# EAGLE schematic Solar_Points (EAGLE 9.6.2)
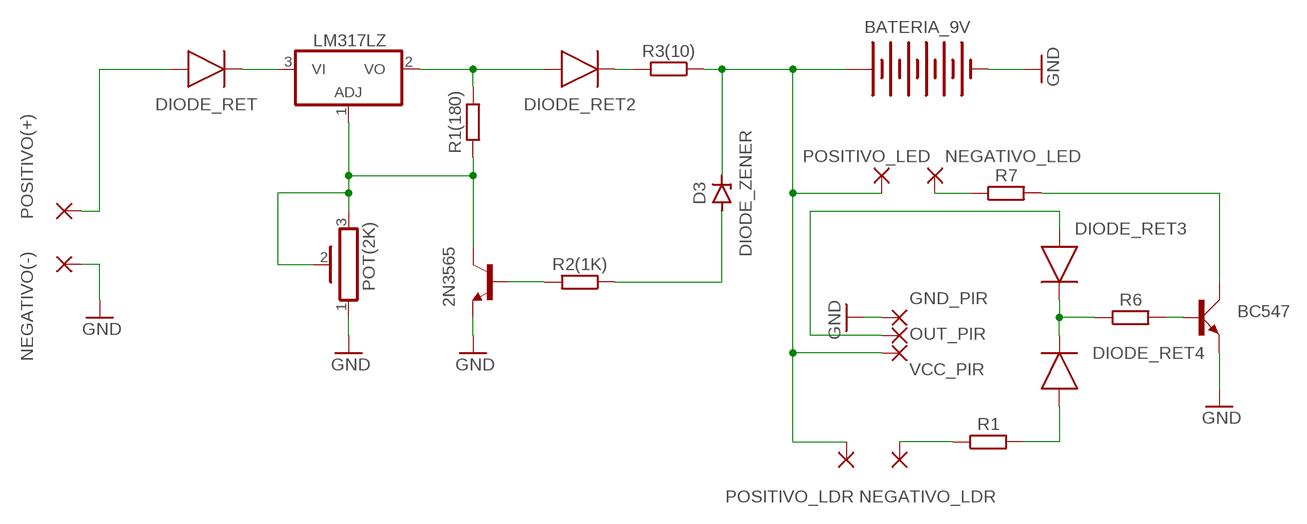
[diagram p0: schematic, sheet 1]

## Parts
2N3565  2N3565  [TO92]
BATERIA_9V  BATTERY-9VGENERIC  [BATTERY-GENERIC]
BC547  BC547  [SOT54A]
D3  DIODE_ZENER  ZENER_DIODE-AXIAL  [DIODE-AXIAL]
DIODE_RET  DIODEDIODE-AXIAL  [DIODE-AXIAL]
DIODE_RET2  DIODEDIODE-AXIAL  [DIODE-AXIAL]
DIODE_RET3  DIODEDIODE-AXIAL  [DIODE-AXIAL]
DIODE_RET4  DIODEDIODE-AXIAL  [DIODE-AXIAL]
GND_PIR  1,6/0,8  [1,6/0,8]
LM317LZ  LM317LZ  [TO92]
NEGATIVO(-)  3,81/1,4  [3,81/1,4]
NEGATIVO_LDR  1,6/0,8  [1,6/0,8]
NEGATIVO_LED  2,15/1,0  [2,15/1,0]
OUT_PIR  1,6/0,8  [1,6/0,8]
POSITIVO(+)  3,81/1,4  [3,81/1,4]
POSITIVO_LDR  1,6/0,8  [1,6/0,8]
POSITIVO_LED  2,15/1,0  [2,15/1,0]
POT(2K)  POT_HA-06  [HA-06-SM065]
R1  RESISTOR_AXIAL-10.16MM-PITCH  [RESAD1016W63L850D250B]
R1(180)  RESISTOR_AXIAL-10.16MM-PITCH  [RESAD1016W63L850D250B]
R2(1K)  RESISTOR_AXIAL-10.16MM-PITCH  [RESAD1016W63L850D250B]
R3(10)  RESISTOR_AXIAL-10.16MM-PITCH  [RESAD1016W63L850D250B]
R6  RESISTOR_AXIAL-10.16MM-PITCH  [RESAD1016W63L850D250B]
R7  RESISTOR_AXIAL-10.16MM-PITCH  [RESAD1016W63L850D250B]
VCC_PIR  1,6/0,8  [1,6/0,8]

## Nets
GND: 2N3565.3(E) BATERIA_9V.- BC547.E GND_PIR.1(P) NEGATIVO(-).1(P) POT(2K).1
N$1: DIODE_RET.1(A) POSITIVO(+).1(P)
N$2: DIODE_RET.2(C) LM317LZ.3(VI)
N$3: 2N3565.1(C) LM317LZ.1(ADJ) POT(2K).2 POT(2K).3 R1(180).1
N$4: DIODE_RET2.1(A) LM317LZ.2(VO) R1(180).2
N$5: DIODE_RET2.2(C) R3(10).2
N$6: BATERIA_9V.+ D3.2(C) POSITIVO_LDR.1(P) POSITIVO_LED.1(P) R3(10).1 VCC_PIR.1(P)
N$7: D3.1(A) R2(1K).1
N$8: 2N3565.2(B) R2(1K).2
N$9: DIODE_RET3.1(A) OUT_PIR.1(P)
N$10: NEGATIVO_LED.1(P) R7.1
N$11: NEGATIVO_LDR.1(P) R1.1
N$12: DIODE_RET3.2(C) DIODE_RET4.2(C) R6.1
N$13: BC547.B R6.2
N$14: BC547.C R7.2
N$15: DIODE_RET4.1(A) R1.2

## Library data of the parts
2N3565 = transistor-neu-to92:2N3565: NPN TRANSISTOR
BATERIA_9V = Tinkercad:BATTERY-9V
BC547 = transistor-small-signal:BC547: NPN TRANSISTOR
D3 = Tinkercad:ZENER: Zener Diode - Generic
DIODE_RET DIODE_RET2-DIODE_RET4 = Tinkercad:DIODE: Diode Rectifier - Generic
GND_PIR NEGATIVO_LDR OUT_PIR POSITIVO_LDR VCC_PIR = wirepad:1,6/0,8: THROUGH-HOLE PAD
LM317LZ = linear:*317: Positive VOLTAGE REGULATOR
NEGATIVO(-) POSITIVO(+) = wirepad:3,81/1,4: THROUGH-HOLE PAD
NEGATIVO_LED POSITIVO_LED = wirepad:2,15/1,0: THROUGH-HOLE PAD
POT(2K) = Tinkercad:POT: Rectangular Trimmer Potentiometers - PV36 Series Datasheet <https://www.bourns.com/docs/Product-Datasheets/pv36.pdf>
R1 R1(180) R2(1K) R3(10) R6 R7 = Tinkercad:RESISTOR: Resistor Fixed - Generic